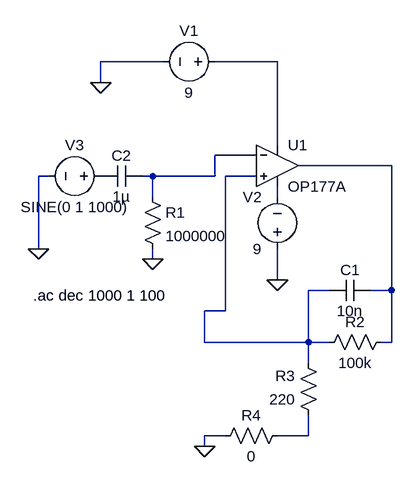
[diagram p0: schematic 1Hz-High-Pass.asc]
1Hz-High-Pass.asc, the LTspice schematic file:
Version 4
SHEET 1 880 888
WIRE 272 272 176 272
WIRE 448 272 352 272
WIRE 176 304 176 272
WIRE 448 400 448 272
WIRE 416 416 352 416
WIRE 624 432 480 432
WIRE 96 448 80 448
WIRE 256 448 240 448
WIRE 352 448 352 416
WIRE 352 448 256 448
WIRE 416 448 368 448
WIRE 256 480 256 448
WIRE 448 480 448 464
WIRE 80 560 80 448
WIRE 256 576 256 560
WIRE 448 608 448 560
WIRE 528 624 496 624
WIRE 624 624 624 432
WIRE 624 624 592 624
WIRE 368 656 368 448
WIRE 368 656 336 656
WIRE 336 704 336 656
WIRE 496 704 496 624
WIRE 496 704 336 704
WIRE 528 704 496 704
WIRE 624 704 624 624
WIRE 624 704 608 704
WIRE 496 736 496 704
WIRE 368 848 336 848
WIRE 496 848 496 816
WIRE 496 848 448 848
WIRE 336 864 336 848
FLAG 336 864 0
FLAG 176 304 0
FLAG 448 608 0
FLAG 80 560 0
FLAG 256 576 0
SYMBOL OpAmps/OP177A 448 368 R0
SYMATTR InstName U1
SYMBOL Voltage 368 272 R90
WINDOW 0 -32 56 VBottom 2
WINDOW 3 32 56 VTop 2
SYMATTR InstName V1
SYMATTR Value 9
SYMBOL Voltage 448 576 R180
WINDOW 0 24 96 Left 2
WINDOW 3 24 16 Left 2
SYMATTR InstName V2
SYMATTR Value 9
SYMBOL Voltage 192 448 R90
WINDOW 0 -32 56 VBottom 2
WINDOW 3 32 56 VTop 2
SYMATTR InstName V3
SYMATTR Value SINE(0 1 1000)
SYMATTR Value2 AC 1
SYMBOL Res 240 464 R0
SYMATTR InstName R1
SYMATTR Value 1000000
SYMBOL Res 624 688 R90
WINDOW 0 0 56 VBottom 2
WINDOW 3 32 56 VTop 2
SYMATTR InstName R2
SYMATTR Value 100k
SYMBOL Res 512 832 R180
WINDOW 0 36 76 Left 2
WINDOW 3 36 40 Left 2
SYMATTR InstName R3
SYMATTR Value 220
SYMBOL Res 352 864 R270
WINDOW 0 32 56 VTop 2
WINDOW 3 0 56 VBottom 2
SYMATTR InstName R4
SYMATTR Value 0
SYMBOL Cap 592 608 R90
WINDOW 0 0 32 VBottom 2
WINDOW 3 32 32 VTop 2
SYMATTR InstName C1
SYMATTR Value 10n
SYMBOL Cap 240 432 R90
WINDOW 0 0 32 VBottom 2
WINDOW 3 32 32 VTop 2
SYMATTR InstName C2
SYMATTR Value 1µ
TEXT 72 632 Left 2 !.ac dec 1000 1 100

The netlist it stands for:
* 1Hz-High-Pass.asc
XU1 N004 N002 N001 N005 N003 OP177A  ; pins In+ In- V+ V- OUT
V1 N001 0 9
V2 0 N005 9
V3 P001 0 SINE(0 1 1000) AC 1
R1 N002 0 1000000
R2 N003 N004 100k
R3 N006 N004 220
R4 0 N006 0
C1 N003 N004 10n
C2 N002 P001 1µ
.ac dec 1000 1 100
.backanno
.end